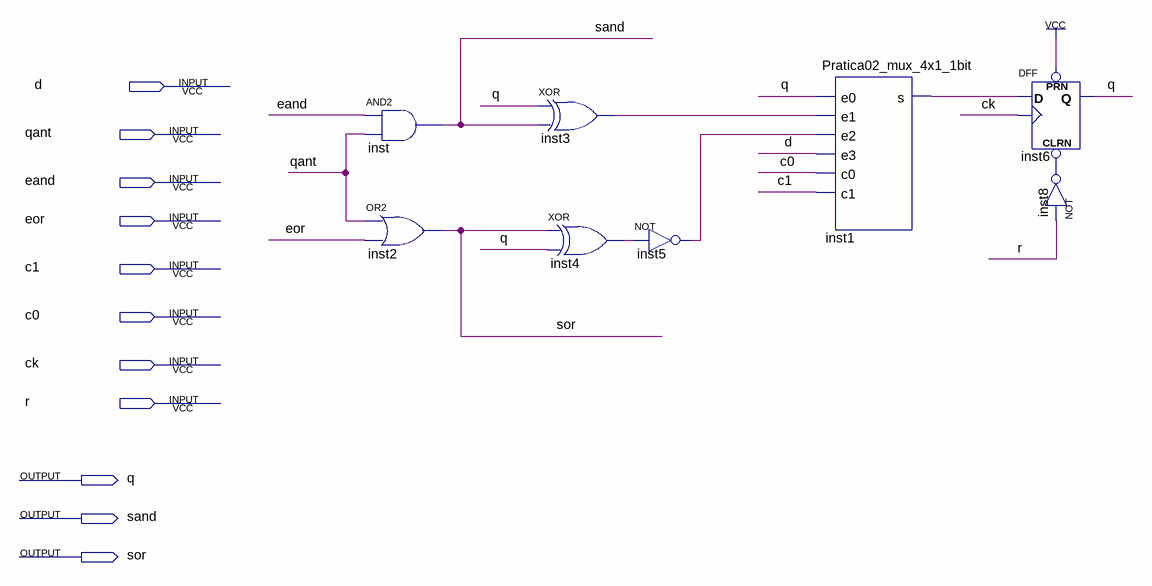
[diagram p0: schematic sheet]
// Quartus schematic Pratica06_cont_gen_1bit.bdf as structural Verilog: 8 symbols, 11 pins
module Pratica06_cont_gen_1bit (
  input  d,
  input  qant,
  input  eand,
  input  eor,
  input  c1,
  input  c0,
  input  ck,
  input  r,
  output q,
  output sand,
  output sor
);

  wire inst1_s, inst3_out, inst4_out, inst5_out, inst8_out;

  and inst (sand, eand, qant);
  or inst2 (sor, qant, eor);
  xor inst3 (inst3_out, q, sand);
  xor inst4 (inst4_out, sor, q);
  not inst5 (inst5_out, inst4_out);
  Pratica02_mux_4x1_1bit inst1 (.e0(q), .e1(inst3_out), .e2(inst5_out), .e3(d), .c0(c0), .c1(c1), .s(inst1_s));
  DFF inst6 (.CLRN(inst8_out), .CLK(ck), .D(inst1_s), .PRN(1'b1), .Q(q));
  not inst8 (inst8_out, r);
endmodule
